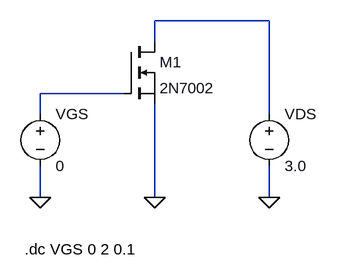
[diagram p0: schematic Lab2circuit1.asc]
Lab2circuit1.asc, the LTspice schematic file:
Version 4
SHEET 1 880 680
WIRE 432 80 256 80
WIRE 256 112 256 80
WIRE 208 192 80 192
WIRE 80 224 80 192
WIRE 432 224 432 80
WIRE 80 352 80 304
WIRE 256 352 256 208
WIRE 432 352 432 304
FLAG 256 352 0
FLAG 432 352 0
FLAG 80 352 0
SYMBOL nmos 208 112 R0
SYMATTR InstName M1
SYMATTR Value 2N7002
SYMBOL voltage 80 208 R0
SYMATTR InstName VGS
SYMATTR Value 0
SYMBOL voltage 432 208 R0
WINDOW 123 0 0 Left 0
WINDOW 39 0 0 Left 0
SYMATTR InstName VDS
SYMATTR Value 3.0
TEXT 56 432 Left 2 !.dc VGS 0 2 0.1

The netlist it stands for:
* Lab2circuit1.asc
M1 N001 N002 0 0 2N7002
VGS N002 0 0
VDS N001 0 3.0
.model NMOS NMOS
.model PMOS PMOS
.lib standard.mos
.dc VGS 0 2 0.1
.backanno
.end